# Altium schematic sheet Э4_1.SchDoc: Оконечное устройство
size 420 x 297 mm; ApprovedBy: Алексеев; CheckedBy: Богданов; Author: Пятиренко; DocumentNumber: ЭАЕСН.464512.002Э4; SheetNumber: 1; SheetTotal: 2; PERVICH PRIM: ЭАЕСН.464512.002; Title2: Схема электрических соединений; DocumentName: Sheet1.SCHDOC; Application_BuildNumber: sdfsdfsdfsdfsdfs
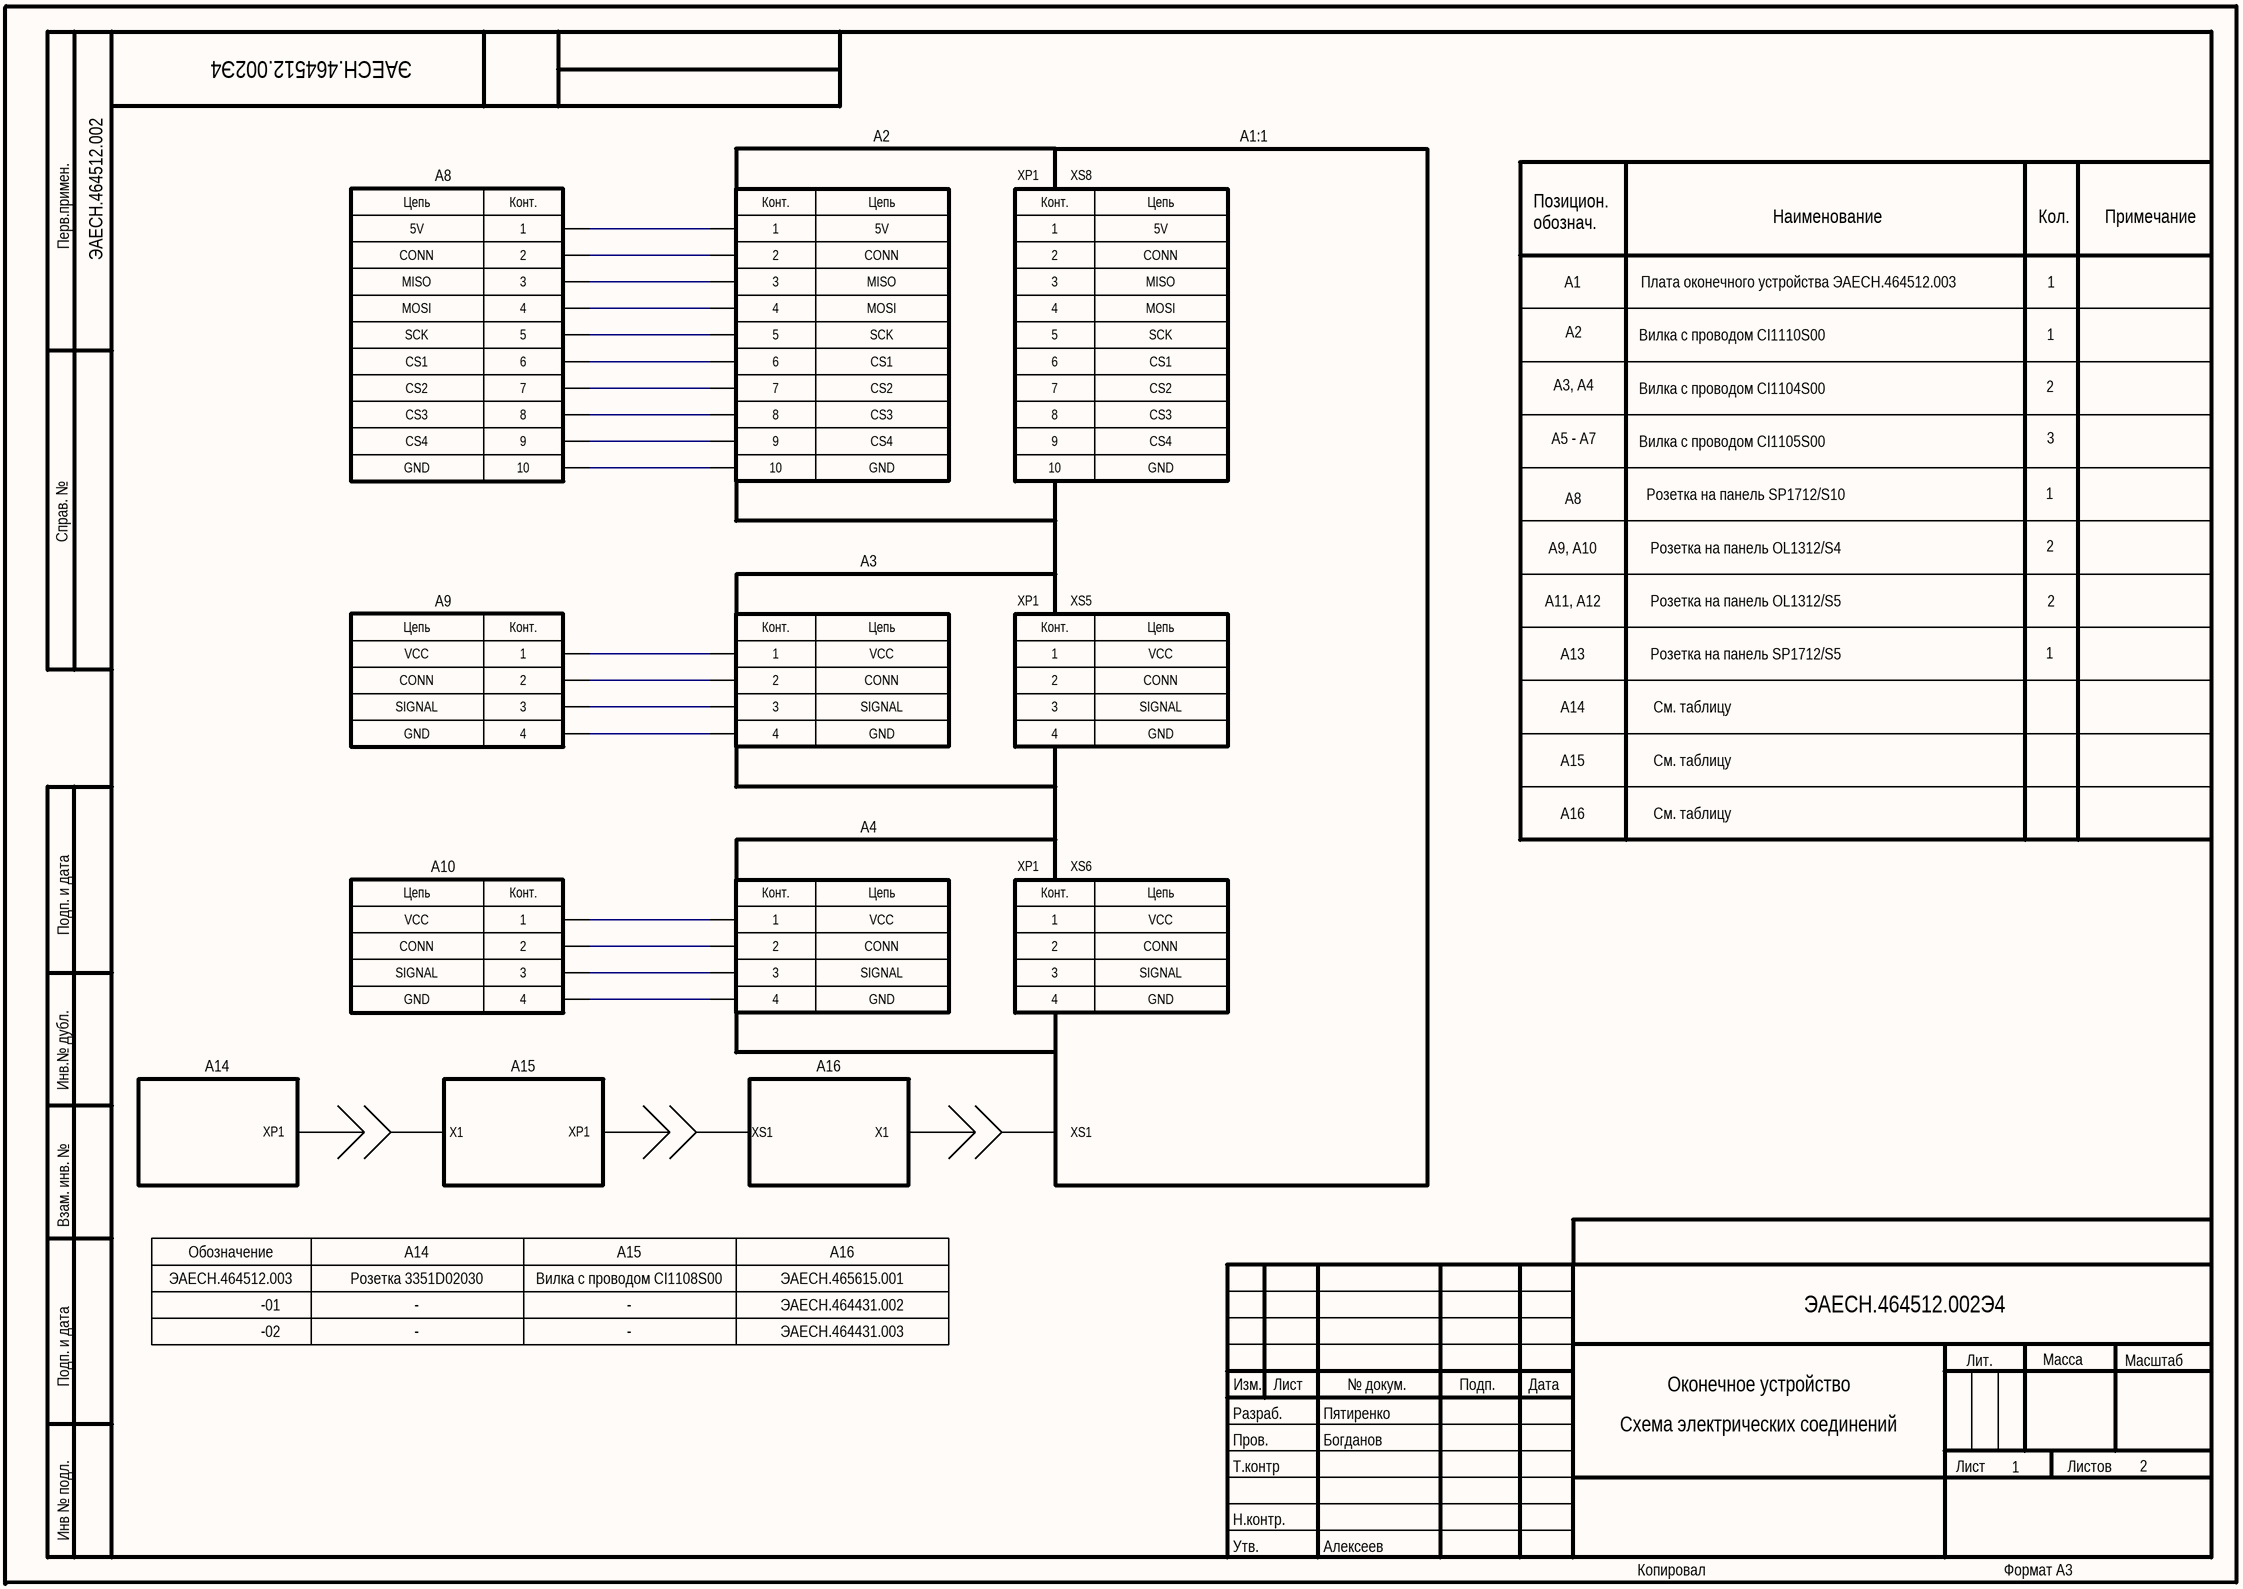
[diagram p0: Э4_1.SchDoc]

## Parts
X4  10pin  (value not drawn)
X5  10pin  (value not drawn)
X6  10pin_con  (value not drawn)
X10  4pin  (value not drawn)
X11  4pin  (value not drawn)
X12  4pin_con  (value not drawn)
X16  4pin  (value not drawn)
X17  4pin  (value not drawn)
X18  4pin_con  (value not drawn)

## Nets
NetX4_1: X4.1 X5.1
NetX4_1: X4.1 X5.1  [a separate net that carries the same name]
NetX4_2: X4.2 X5.2
NetX4_2: X4.2 X5.2  [a separate net that carries the same name]
NetX4_3: X4.3 X5.3
NetX4_3: X4.3 X5.3  [a separate net that carries the same name]
NetX4_4: X4.4 X5.4
NetX4_4: X4.4 X5.4  [a separate net that carries the same name]
NetX4_4: X4.4 X5.4  [a separate net that carries the same name]
NetX4_4: X4.4 X5.4  [a separate net that carries the same name]
NetX10_1: X10.1 X11.1
NetX10_2: X10.2 X11.2
NetX10_3: X10.3 X11.3
NetX10_4: X10.4 X11.4
NetX16_1: X16.1 X17.1
NetX16_2: X16.2 X17.2
NetX16_3: X16.3 X17.3
NetX16_4: X16.4 X17.4

## Notes on the sheet
- A8
- A2
- (near X6) XP1
- XS8
- A1:1
- 5V
- CONN
- Позицион.
  обознач.
- Наименование
- Кол.
- Примечание
- MISO
- MOSI
- SCK
- A1
- Вилка с проводом CI1110S00
- Плата оконечного устройства ЭАЕСН.464512.003
- 1
- CS1
- CS2
- A3, А4
- Вилка с проводом CI1104S00
- 2
- GND
- CS3
- CS4
- A5 - A7
- Вилка с проводом CI1105S00
- 3
- Розетка на панель SP1712/S10
- A9
- A3
- (near X12) XP1
- XS5
- A9, А10
- A11, А12
- Розетка на панель OL1312/S4
- Розетка на панель OL1312/S5
- VCC
- A13
- Розетка на панель SP1712/S5
- SIGNAL
- A14
- См. таблицу
- A15
- A10
- A4
- (near X18) XP1
- XS6
- A16
- XP1
- X1
- XS1
- Обозначение
- ЭАЕСН.464512.003
- Розетка 3351D02030
- Вилка с проводом CI1108S00
- ЭАЕСН.465615.001
- -01
- -02
- -
- ЭАЕСН.464431.002
- ЭАЕСН.464431.003
- Перв.примен.
- Справ. №
- Подп. и дата
- Инв.№ дубл.
- Взам. инв. №
- Изм.
- Лист
- № докум.
- Подп.
- Дата
- Лит.
- Масса
- Масштаб
- Пров.
- Т.контр
- Разраб.
- Листов
- Инв № подл.
- Н.контр.
- Утв.
- Копировал
- Формат А3
- (in symbol 4pin) Конт.; Цепь
- (in symbol 4pin_con) Конт.; Цепь; 1; 2; 3; 4
- (in symbol 10pin) Конт.; Цепь; 5; 6; 7; 8; 9; 10
- (in symbol 10pin_con) Конт.; Цепь; 1; 2; 3; 4; 5; 6; 7; 8; 9; 10